# Altium schematic sheet GZ7_1_x-SIM800C.SchDoc: GZ8-4-0
size B; SheetNumber: 6; SheetTotal: 10
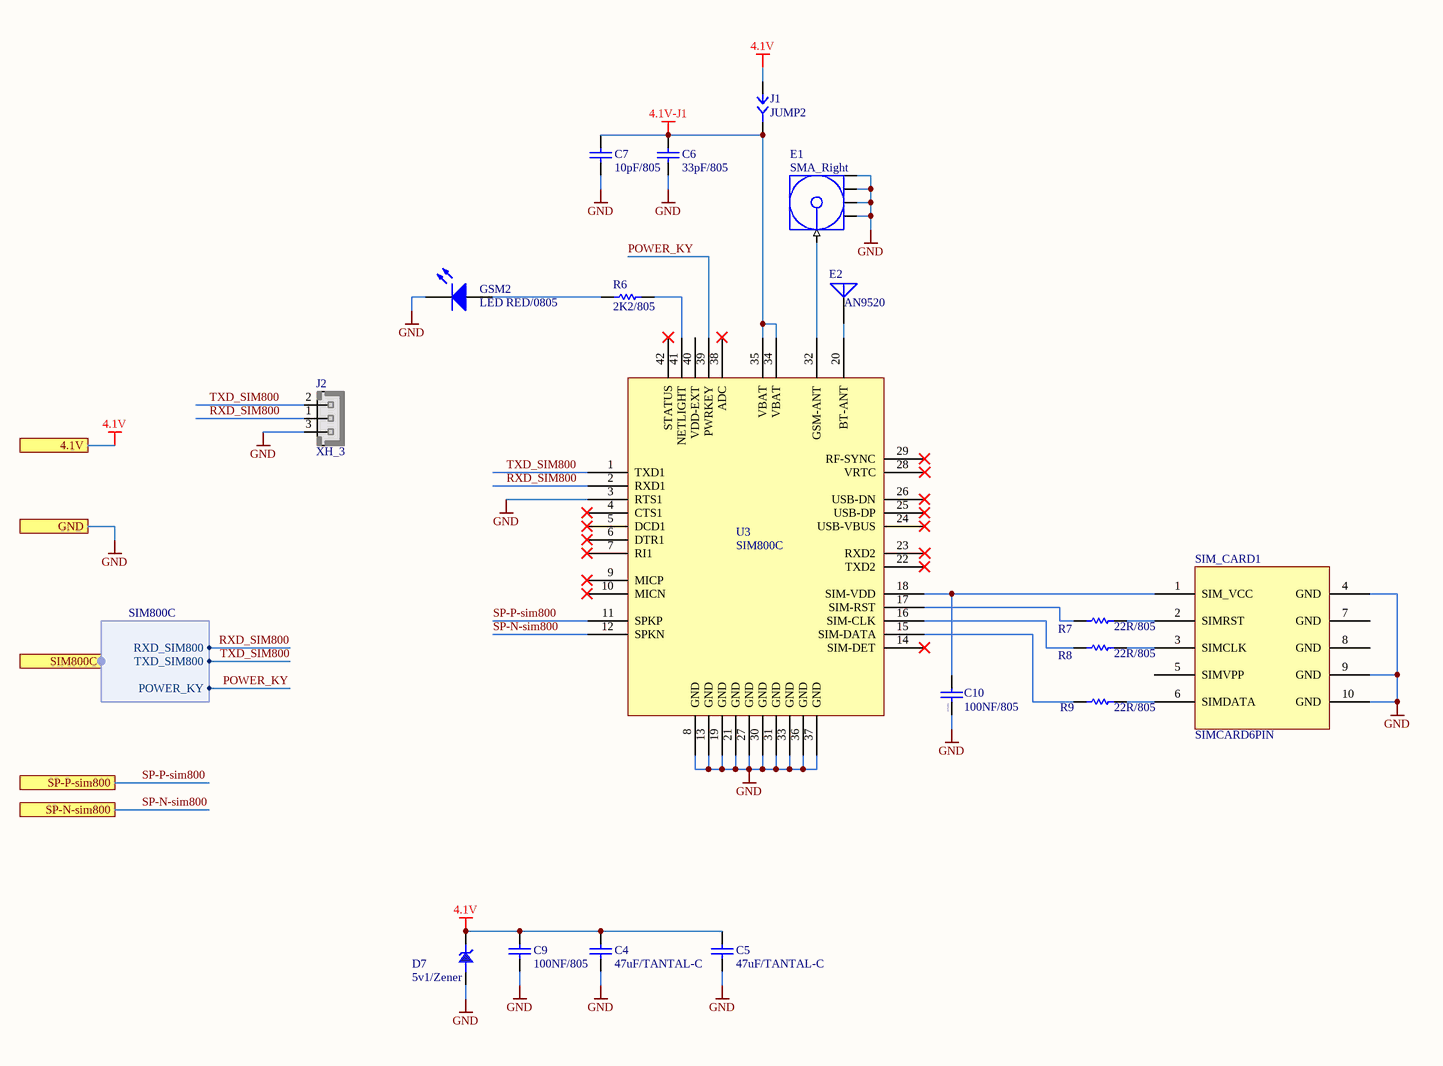
[diagram p0: GZ7_1_x-SIM800C.SchDoc]

## Parts
C4  47uF/TANTAL-C  [C-TT1]
C5  47uF/TANTAL-C  [C-TT1]
C6  33pF/805  [MY805 COP]
C7  10pF/805  [MY805 COP]
C9  100NF/805  [MY805 COP]
C10  100NF/805  [MY805 COP]
D7  5v1/Zener  [my-DO5X.1.5]
E1  SMA_Right  [MCX5.08-H5]
E2  AN9520  [ANT-SMD]
GSM2  LED RED/0805  [LED_SMD_0805]
J1  JUMP2  [JUMP3]
J2  XH_3  [XH_3]
R6  2K2/805  [my805]
R7  22R/805  [my805]
R8  22R/805  [my805]
R9  22R/805  [my805]
SIM_CARD1  SIMCARD6PIN  [MinSim]
U3  SIM800C  [SIM800C_2]

## Ports
4.1V, GND, SIM800C (harness SIM800C), SP-N-sim800, SP-P-sim800

## Harnesses
SIM800C: TXD_SIM800, RXD_SIM800, POWER_KY

## Nets
4.1V: C4.1 C5.1 C9.1 D7.2 J1.2 ; port 4.1V
4.1V-J1: C6.1 C7.1 J1.1 U3.34(VBAT) U3.35(VBAT)
GND: C4.2 C5.2 C6.2 C7.2 C9.2 C10.1 D7.1 E1.2(GND) E1.3(GND) E1.4(GND) E1.5(GND) GSM2.2(K) J2.3 SIM_CARD1.4(GND) SIM_CARD1.9(GND) SIM_CARD1.10(GND) U3.3(RTS1) U3.8(GND) U3.13(GND) U3.19(GND) U3.21(GND) U3.27(GND) U3.30(GND) U3.31(GND) U3.33(GND) U3.36(GND) U3.37(GND) ; port GND
POWER_KY: U3.39(PWRKEY) ; port SIM800C.POWER_KY
RXD_SIM800: J2.1 U3.2(RXD1) ; port SIM800C.RXD_SIM800
SP-N-sim800: U3.12(SPKN) ; port SP-N-sim800
SP-P-sim800: U3.11(SPKP) ; port SP-P-sim800
TXD_SIM800: J2.2 U3.1(TXD1) ; port SIM800C.TXD_SIM800
NetC10_2: C10.2 SIM_CARD1.1(SIM_VCC) U3.18(SIM-VDD)
NetE1_1: E1.1(Signal) U3.32(GSM-ANT)
NetE2_1: E2.1(A) U3.20(BT-ANT)
NetGSM2_1: GSM2.1(A) R6.1
NetR6_2: R6.2 U3.41(NETLIGHT)
NetR7_1: R7.1 SIM_CARD1.2(SIMRST)
NetR7_2: R7.2 U3.17(SIM-RST)
NetR8_1: R8.1 SIM_CARD1.3(SIMCLK)
NetR8_2: R8.2 U3.16(SIM-CLK)
NetR9_1: R9.1 SIM_CARD1.6(SIMDATA)
NetR9_2: R9.2 U3.15(SIM-DATA)

Not connected (* = marked no-connect by the designer): SIM_CARD1 5(SIMVPP) 7(GND) 8(GND); U3 4(CTS1)* 5(DCD1)* 6(DTR1)* 7(RI1)* 9(MICP)* 10(MICN)* 14(SIM-DET)* 22(TXD2)* 23(RXD2)* 24(USB-VBUS)* 25(USB-DP)* 26(USB-DN)* 28(VRTC)* 29(RF-SYNC)* 38(ADC)* 40(VDD-EXT) 42(STATUS)*

## Notes on the sheet
- Serial Number:
- Altium Vip Course
- Title:
- Revision:
- Approved By:
- Date:
- Sheet       of
- SheetTotal
- Sheet Size: B
- File:
- (in symbol CAP) @ebrahim

## Library data of the parts
C4 C5 = Cap Semi: TANTAL
C6 = Cap Semi: CAP 0805; Value: 100NF; Published: 8-Jun-2000; LatestRevisionDate: 29-May-2009; LatestRevisionNote: IPC-7351 Footprint Added.; PackageReference: C1206; Publisher: Altium Limited; PackageDescription: Chip Capacitor
C7 = Cap Semi: CAP 0805; Value: 10pF; Published: 8-Jun-2000; LatestRevisionDate: 29-May-2009; LatestRevisionNote: IPC-7351 Footprint Added.; PackageReference: C1206; Publisher: Altium Limited; PackageDescription: Chip Capacitor
C9 = Cap Semi: CAP 0805; Published: 8-Jun-2000; LatestRevisionDate: 29-May-2009; LatestRevisionNote: IPC-7351 Footprint Added.; PackageReference: C1206; Publisher: Altium Limited; PackageDescription: Chip Capacitor
C10 = CAP: CAP 0805
D7 = Zener
E1 = COAX-F: 50 Ohm Impedance; PCB_Layout: Complies with manufacturer's recommendation.; DrillSize: Corresponds to nominal value.; Published: 15-Jul-2004; LatestRevisionDate: 15-Jul-2004; LatestRevisionNote: Component Replaced.; DatasheetDocument: 30-May-2003; PackageDocument: 04-Jul-1999; PackageReference: 919-119J-51AX; Publisher: Altium Limited; ComponentLink1Description: Manufacturer Link; ComponentLink1URL: http://www.amphenolrf.com/
E2 = Antenna: Multilayer Chip Antenna; Published: 24-Mar-1999; LatestRevisionDate: 17-Jul-2002; LatestRevisionNote: Re-released for DXP Platform.; PackageReference: PIN1; Publisher: Altium Limited
GSM2 = LED2: Published: 8-Jun-2000; LatestRevisionDate: 17-Jul-2002; LatestRevisionNote: Re-released for DXP Platform.; PackageVersion: Feb-2002; PackageReference: 3.2X1.6X1.1; Publisher: Altium Limited; PackageDescription: SM LED; 2 Flat Leads
J2 = XH_3: PW10-x-M, JST-BxB-XH-A pitch: 2.5mm, 3A/250v; MANF: JST; MANF_P#: B3B-XH-A; PARAM2: 250v; PARAM: 3.0A; VALUE: XH_3
R6 = Res1: RES 805
R7-R9 = Res1: RES 805; Value: 22R; Published: 8-Jun-2000; LatestRevisionDate: 17-Jul-2002; LatestRevisionNote: Re-released for DXP Platform.; PackageReference: AXIAL-0.3; Publisher: Altium Limited